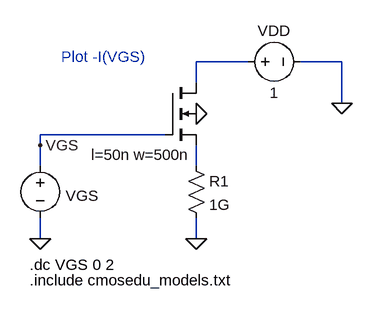
[diagram p0: schematic Fig16_66.asc]
Fig16_66.asc, the LTspice schematic file:
Version 4
SHEET 1 1748 680
WIRE 704 -256 624 -256
WIRE 848 -256 784 -256
WIRE 624 -224 624 -256
WIRE 848 -192 848 -256
WIRE 576 -144 384 -144
WIRE 384 -128 384 -144
WIRE 384 -96 384 -128
WIRE 624 -96 624 -128
WIRE 384 16 384 -16
WIRE 624 16 624 -16
FLAG 624 -176 0
FLAG 384 16 0
FLAG 384 -128 VGS
FLAG 848 -192 0
FLAG 624 16 0
SYMBOL nmos4 576 -224 R0
WINDOW 0 104 24 Invisible 0
WINDOW 3 179 41 Invisible 0
WINDOW 123 -114 111 Left 0
SYMATTR InstName M1
SYMATTR Value N_50n
SYMATTR Value2 l=50n w=500n
SYMBOL voltage 384 -112 R0
WINDOW 123 0 0 Left 0
WINDOW 39 0 0 Left 0
WINDOW 3 40 53 Invisible 0
WINDOW 0 39 62 Left 0
SYMATTR Value 1
SYMATTR InstName VGS
SYMBOL res 608 -112 R0
SYMATTR InstName R1
SYMATTR Value 1G
SYMBOL voltage 688 -256 R270
WINDOW 0 32 56 VTop 0
WINDOW 3 -32 56 VBottom 0
SYMATTR InstName VDD
SYMATTR Value 1
TEXT 368 80 Left 0 !.include cmosedu_models.txt
TEXT 368 56 Left 0 !.dc VGS 0 2 
TEXT 416 -264 Left 0 ;Plot -I(VGS)

The netlist it stands for:
* Fig16_66.asc
M1 N001 VGS N002 0 N_50n l=50n w=500n
VGS VGS 0 1
R1 N002 0 1G
VDD N001 0 1
.model NMOS NMOS
.model PMOS PMOS
.lib standard.mos
.include cmosedu_models.txt
.dc VGS 0 2
* Plot -I(VGS)
.backanno
.end